# Altium schematic sheet Supply_12V.SchDoc
size C; SheetNumber: 9; SheetTotal: 10
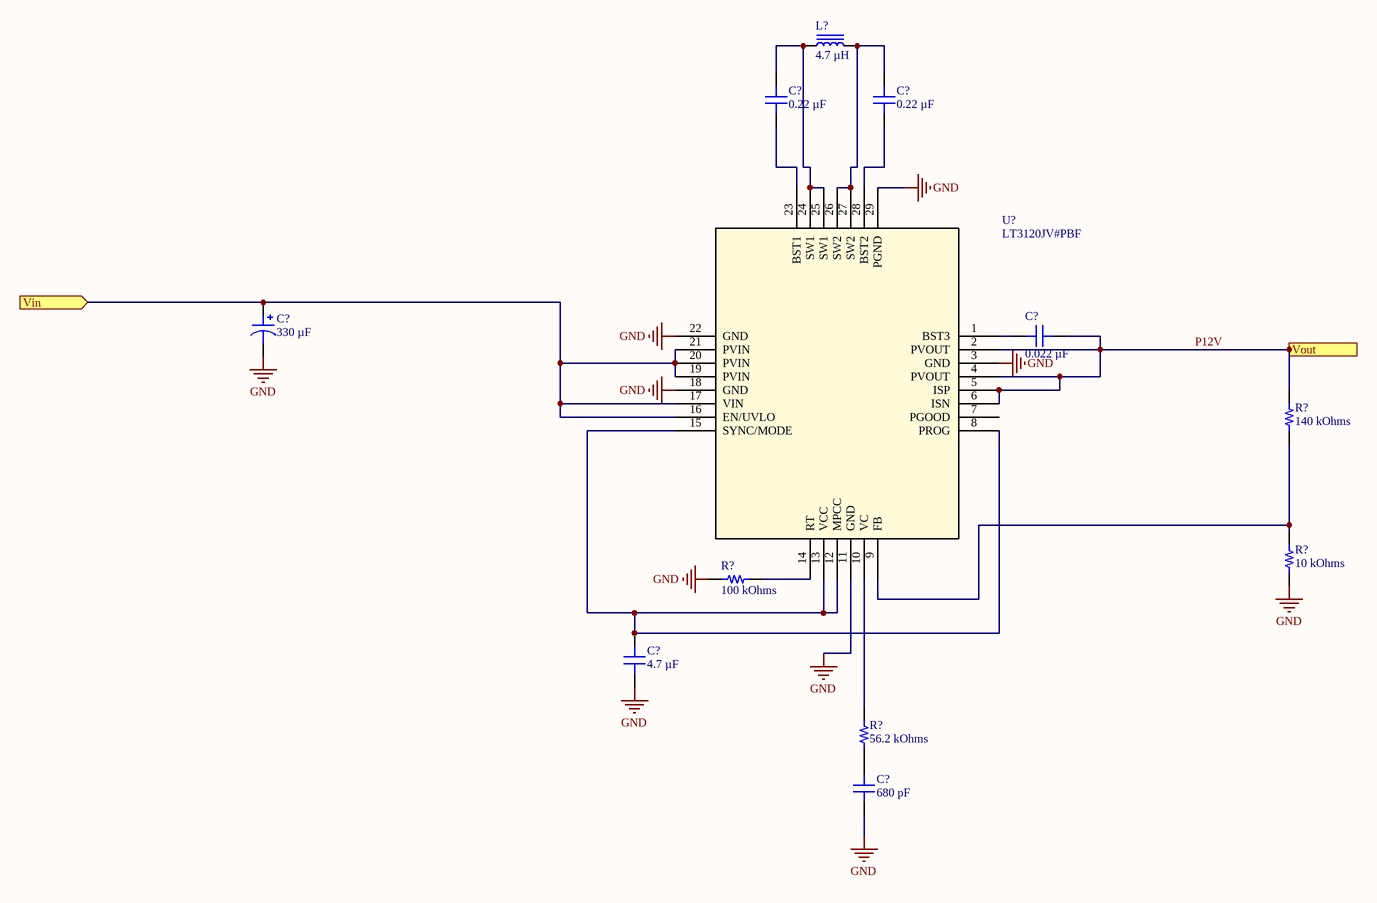
[diagram p0: Supply_12V.SchDoc]

## Parts
(Parts that share a designator on the sheet are numbered #1, #2 ... from top to bottom, then left to right.)
C?#1  0.22 µF  [CAP 0805_2012]
C?#2  0.22 µF  [CAP 0805_2012]
C?#3  330 µF  [CAP ALSMD 8.3MM H10.5MM]
C?#4  0.022 µF  [CAP 0805_2012]
C?#5  4.7 µF  [CAP 1206_3216 - 0.8MM]
C?#6  680 pF  [CAP 0805_2012]
L?  4.7 µH  [WURTH WE-HCI 7040]
R?#1  140 kOhms  [RES 0805_2012]
R?#2  10 kOhms  [RES 0805_2012]
R?#3  100 kOhms  [RES 0805_2012]
R?#4  56.2 kOhms  [RES 0805_2012]
U?  LT3120JV#PBF  [LQFN28_Rev0_ADI]

## Ports
Vin (in), Vout (out)

## Nets
GND: C?#3.2 C?#5.1 C?#6.1 R?#2.1 R?#3.1 U?.3(GND) U?.11(GND) U?.18(GND) U?.22(GND) U?.29(PGND)
P12V: C?#4.2 R?#1.2 U?.2(PVOUT) U?.4(PVOUT) U?.5(ISP) U?.6(ISN) ; port Vout
Vin: C?#3.1 U?.16(EN/UVLO) U?.17(VIN) U?.19(PVIN) U?.20(PVIN) U?.21(PVIN) ; port Vin
NetC?#1_1: C?#1.1 U?.23(BST1)
NetC?#1_2: C?#1.2 L?.1 U?.24(SW1) U?.25(SW1)
NetC?#2_1: C?#2.1 U?.28(BST2)
NetC?#2_2: C?#2.2 L?.2 U?.26(SW2) U?.27(SW2)
NetC?#4_1: C?#4.1 U?.1(BST3)
NetC?#5_2: C?#5.2 U?.8(PROG) U?.12(MPCC) U?.13(VCC) U?.15(SYNC/MODE)
NetC?#6_2: C?#6.2 R?#4.1
NetR?#1_1: R?#1.1 R?#2.2 U?.9(FB)
NetR?#3_2: R?#3.2 U?.14(RT)
NetR?#4_2: R?#4.2 U?.10(VC)

Not connected (* = marked no-connect by the designer): U? 7(PGOOD)

## Library data of the parts
C?#1 C?#2 = C0805C224K5RACAUTO: CAP CER 0.22UF 50V X7R 0805; manufacturer: KEMET; Tolerance: ±10%; Part Number: C0805C224K5RACAUTO; Value: 0.22 µF; Applications: Automotive, Bypass, Decoupling; Capacitance: 0.22 µF; componentlink1description: Datasheet; componentlink1url: https://api.kemet.com/component-edge/download/datasheet/C0805C224K5RACAUTO.pdf; componentlink2description: DigiKey Link; componentlink2url: https://www.digikey.com/en/products/detail/kemet/C0805C224K5RACAUTO/3314941; Device Package: 0805 (2012 Metric); lastupdated: 6/3/2023 7:17:15 PM; Lifecycle Status: Active; Minimum Order: 1; Mounting Type: Surface Mount, MLCC; Operating Temperature: -55°C ~ 125°C; Package / Case: 0805 (2012 Metric); packaging: TapeAndReel; partid: 8639; Part Status: Active; price: 0.02; Ratings: AEC-Q200; series: SMD Auto X7R; Size / Dimension: 0.079" L x 0.049" W (2.00mm x 1.25mm); Supplier 1: DigiKey; Supplier Part Number 1: 399-6949-1-ND; Temperature Coefficient: X7R; Thickness (Max): 0.039" (1.00mm); Voltage - Rated: 50V
C?#3 = UCM1V331MNL1GS: CAP ALUM 330UF 20% 35V SMD; manufacturer: Nichicon; Impedance: 80 mOhms; Lifetime @ Temp.: 2000 Hrs @ 105°C; Polarization: Polar; Ripple Current @ High Frequency: 850 mA @ 100 kHz; Ripple Current @ Low Frequency: 425 mA @ 120 Hz; Surface Mount Land Size: 0.327" L x 0.327" W (8.30mm x 8.30mm); Part Number: UCM1V331MNL1GS; Applications: Automotive; Capacitance: 330 µF; componentlink1description: Datasheet; componentlink1url: http://nichicon-us.com/english/products/pdfs/e-ucm.pdf; componentlink2description: DigiKey Link; componentlink2url: https://www.digikey.com/en/products/detail/nichicon/UCM1V331MNL1GS/4991864; Device Package: Radial, Can - SMD; Height - Seated (Max): 0.413" (10.50mm); lastupdated: 6/2/2023 8:33:36 PM; Lifecycle Status: Active; Minimum Order: 1; Mounting Type: Surface Mount; Operating Temperature: -55°C ~ 105°C; Package / Case: Radial, Can - SMD; packaging: TapeAndReel; partid: 7822; Part Status: Active; price: 0.20; Ratings: AEC-Q200; series: UCM; Size / Dimension: 0.315" Dia (8.00mm); Supplier 1: DigiKey; Supplier Part Number 1: 493-14539-1-ND; Tolerance: ±20%; value: 330 µF; Voltage - Rated: 35 V
C?#4 = C0805C223K5RACAUTO: CAP CER 0.022UF 50V X7R 0805; manufacturer: KEMET; Tolerance: ±10%; Part Number: C0805C223K5RACAUTO; Value: 0.022 µF; Applications: Automotive, Bypass, Decoupling; Capacitance: 0.022 µF; componentlink1description: Datasheet; componentlink1url: https://api.kemet.com/component-edge/download/datasheet/C0805C223K5RACAUTO.pdf; componentlink2description: DigiKey Link; componentlink2url: https://www.digikey.com/en/products/detail/kemet/C0805C223K5RACAUTO/3314937; Device Package: 0805 (2012 Metric); lastupdated: 6/3/2023 7:17:25 PM; Lifecycle Status: Active; Minimum Order: 1; Mounting Type: Surface Mount, MLCC; Operating Temperature: -55°C ~ 125°C; Package / Case: 0805 (2012 Metric); packaging: TapeAndReel; partid: 4413; Part Status: Active; price: 0.01; Ratings: AEC-Q200; series: SMD Auto X7R; Size / Dimension: 0.079" L x 0.049" W (2.00mm x 1.25mm); Supplier 1: DigiKey; Supplier Part Number 1: 399-6945-1-ND; Temperature Coefficient: X7R; Thickness (Max): 0.035" (0.88mm); Voltage - Rated: 50V
C?#5 = C1206C475K5RAC7800: CAP CER 4.7UF 50V X7R 1206; manufacturer: KEMET; Tolerance: ±10%; Part Number: C1206C475K5RAC7800; Value: 4.7 µF; Applications: Bypass, Decoupling; Capacitance: 4.7 µF; componentlink1description: Datasheet; componentlink1url: https://api.kemet.com/component-edge/download/datasheet/C1206C475K5RACTU.pdf; componentlink2description: DigiKey Link; componentlink2url: https://www.digikey.com/en/products/detail/kemet/C1206C475K5RAC7800/5119822; Device Package: 1206 (3216 Metric); lastupdated: 6/3/2023 7:19:26 PM; Lifecycle Status: Active; Minimum Order: 1; Mounting Type: Surface Mount, MLCC; Operating Temperature: -55°C ~ 125°C; Package / Case: 1206 (3216 Metric); packaging: TapeAndReel; partid: 38858; Part Status: Active; price: 0.07; series: SMD Comm X7R; Size / Dimension: 0.126" L x 0.063" W (3.20mm x 1.60mm); Supplier 1: DigiKey; Supplier Part Number 1: 399-C1206C475K5RAC7800CT-ND; Temperature Coefficient: X7R; Thickness (Max): 0.071" (1.80mm); Voltage - Rated: 50V
C?#6 = C0805C681K5RAC7800: CAP CER 680PF 50V X7R 0805; manufacturer: KEMET; Tolerance: ±10%; Part Number: C0805C681K5RAC7800; Value: 680 pF; Applications: Bypass, Decoupling; Capacitance: 680 pF; componentlink1description: Datasheet; componentlink1url: https://api.kemet.com/component-edge/download/datasheet/C0805C681K5RACTU.pdf; componentlink2description: DigiKey Link; componentlink2url: https://www.digikey.com/en/products/detail/kemet/C0805C681K5RAC7800/411143; Device Package: 0805 (2012 Metric); lastupdated: 6/3/2023 7:16:33 PM; Lifecycle Status: Active; Minimum Order: 1; Mounting Type: Surface Mount, MLCC; Operating Temperature: -55°C ~ 125°C; Package / Case: 0805 (2012 Metric); packaging: TapeAndReel; partid: 32912; Part Status: Active; price: 0.04; series: SMD Comm X7R; Size / Dimension: 0.079" L x 0.049" W (2.00mm x 1.25mm); Supplier 1: DigiKey; Supplier Part Number 1: 399-C0805C681K5RAC7800CT-ND; Temperature Coefficient: X7R; Thickness (Max): 0.035" (0.88mm); Voltage - Rated: 50V
L? = 744311470: FIXED IND 4.7UH 6A 19.5 MOHM SMD; Manufacturer: Würth Elektronik; Current - Saturation: 7A; Frequency - Self Resonant: 33MHz; Inductance Frequency - Test: 100 kHz; Material - Core: Nonstandard; Shielding: Shielded; Tolerance: ±20%; Type: Wirewound; Part Number: 744311470; ComponentLink1Description: Datasheet; ComponentLink1URL: https://katalog.we-online.de/pbs/datasheet/744311470.pdf; ComponentLink2Description: DigiKey Link; ComponentLink2URL: https://www.digikey.com/en/products/detail/würth-elektronik/744311470/1638558; Current Rating (Amps): 6 A; DC Resistance (DCR): 19.5mOhm; Device Package: Nonstandard; Height - Seated (Max): 0.157" (4.00mm); Inductance: 4.7 µH; LastUpdated: 6/3/2023 8:33:14 PM; Lifecycle Status: Active; Minimum Order: 1; Mounting Type: Surface Mount; Operating Temperature: -40°C ~ 150°C; Package / Case: Nonstandard; Packaging: TapeAndReel; PartId: 258; Part Status: Active; Price: 2.72; Ratings: AEC-Q200; Series: WE-HCI; Size / Dimension: 0.276" L x 0.272" W (7.00mm x 6.90mm); Supplier 1: DigiKey; Supplier Part Number 1: 732-1153-1-ND; Supplier Device Package: 7040; Value: 4.7 µH
R?#1 = ERA-6AEB1403V: RES 140K OHM 0.1% 1/8W 0805; Manufacturer: Panasonic Electronic Components; Power (Watts): 0.125W, 1/8W; Temperature Coefficient: ±25ppm/°C; Part Number: ERA-6AEB1403V; Value: 140 kOhms; ComponentLink1Description: Datasheet; ComponentLink1URL: https://industrial.panasonic.com/cdbs/www-data/pdf/RDM0000/AOA0000C307.pdf; ComponentLink2Description: DigiKey Link; ComponentLink2URL: https://www.digikey.com/en/products/detail/panasonic-electronic-components/ERA-6AEB1403V/2025855; Composition: Thin Film; Device Package: 0805 (2012 Metric); Features: Automotive AEC-Q200; Height - Seated (Max): 0.024" (0.60mm); LastUpdated: 6/3/2023 7:57:36 PM; Lifecycle Status: Active; Minimum Order: 1; Number of Terminations: 2; Operating Temperature: -55°C ~ 155°C; Package / Case: 0805 (2012 Metric); Packaging: TapeAndReel; PartId: 31050; Part Status: Active; Price: 0.03; Ratings: AEC-Q200; Resistance: 140 kOhms; Series: ERA-6A; Size / Dimension: 0.079" L x 0.049" W (2.00mm x 1.25mm); Supplier 1: DigiKey; Supplier Part Number 1: 10-ERA-6AEB1403VCT-ND; Supplier Device Package: 0805; Tolerance: ±0.1%
R?#2 = ERA-6AEB103V: RES 10K OHM 0.1% 1/8W 0805; Manufacturer: Panasonic Electronic Components; Power (Watts): 0.125W, 1/8W; Temperature Coefficient: ±25ppm/°C; Part Number: ERA-6AEB103V; Value: 10 kOhms; ComponentLink1Description: Datasheet; ComponentLink1URL: https://industrial.panasonic.com/cdbs/www-data/pdf/RDM0000/AOA0000C307.pdf; ComponentLink2Description: DigiKey Link; ComponentLink2URL: https://www.digikey.com/en/products/detail/panasonic-electronic-components/ERA-6AEB103V/1465773; Composition: Thin Film; Device Package: 0805 (2012 Metric); Features: Automotive AEC-Q200; Height - Seated (Max): 0.024" (0.60mm); LastUpdated: 6/3/2023 7:57:45 PM; Lifecycle Status: Active; Minimum Order: 1; Number of Terminations: 2; Operating Temperature: -55°C ~ 155°C; Package / Case: 0805 (2012 Metric); Packaging: TapeAndReel; PartId: 28062; Part Status: Active; Price: 0.04; Ratings: AEC-Q200; Resistance: 10 kOhms; Series: ERA-6A; Size / Dimension: 0.079" L x 0.049" W (2.00mm x 1.25mm); Supplier 1: DigiKey; Supplier Part Number 1: P10KDACT-ND; Supplier Device Package: 0805; Tolerance: ±0.1%
R?#3 = KTR10EZPF1003: RES SMD 100K OHM 1% 1/8W 0805; Manufacturer: Rohm Semiconductor; Power (Watts): 0.125W, 1/8W; Temperature Coefficient: ±100ppm/°C; Part Number: KTR10EZPF1003; Value: 100 kOhms; ComponentLink1Description: Datasheet; ComponentLink1URL: https://www.rohm.com/datasheet/KTR03EZPF/ktr-e; ComponentLink2Description: DigiKey Link; ComponentLink2URL: https://www.digikey.com/en/products/detail/rohm-semiconductor/KTR10EZPF1003/1983627; Composition: Thick Film; Device Package: 0805 (2012 Metric); Features: Automotive AEC-Q200, High Voltage; Height - Seated (Max): 0.026" (0.65mm); LastUpdated: 6/3/2023 7:57:09 PM; Lifecycle Status: Active; Minimum Order: 1; Number of Terminations: 2; Operating Temperature: -55°C ~ 155°C; Package / Case: 0805 (2012 Metric); Packaging: TapeAndReel; PartId: 36659; Part Status: Active; Price: 0.02; Ratings: AEC-Q200; Resistance: 100 kOhms; Series: KTR; Size / Dimension: 0.079" L x 0.049" W (2.00mm x 1.25mm); Supplier 1: DigiKey; Supplier Part Number 1: RHM100KAHCT-ND; Supplier Device Package: 0805; Tolerance: ±1%
R?#4 = KTR10EZPF5622: RES SMD 56.2K OHM 1% 1/8W 0805; Manufacturer: Rohm Semiconductor; Power (Watts): 0.125W, 1/8W; Temperature Coefficient: ±100ppm/°C; Part Number: KTR10EZPF5622; Value: 56.2 kOhms; ComponentLink1Description: Datasheet; ComponentLink1URL: https://www.rohm.com/datasheet/KTR03EZPF/ktr-e; ComponentLink2Description: DigiKey Link; ComponentLink2URL: https://www.digikey.com/en/products/detail/rohm-semiconductor/KTR10EZPF5622/4052106; Composition: Thick Film; Device Package: 0805 (2012 Metric); Features: Automotive AEC-Q200, High Voltage; Height - Seated (Max): 0.026" (0.65mm); LastUpdated: 6/3/2023 7:56:48 PM; Lifecycle Status: Active; Minimum Order: 1; Number of Terminations: 2; Operating Temperature: -55°C ~ 155°C; Package / Case: 0805 (2012 Metric); Packaging: TapeAndReel; PartId: 41098; Part Status: Active; Price: 0.02; Ratings: AEC-Q200; Resistance: 56.2 kOhms; Series: KTR; Size / Dimension: 0.079" L x 0.049" W (2.00mm x 1.25mm); Supplier 1: DigiKey; Supplier Part Number 1: RHM56.2KAHCT-ND; Supplier Device Package: 0805; Tolerance: ±1%
U? = LT3120JV#PBF: No Description Available; Mfr_Name: Analog Devices Inc; RefDes: RefDes; Type: Type